# Altium project FSAES-23-E17 Temp Module.PrjPcb
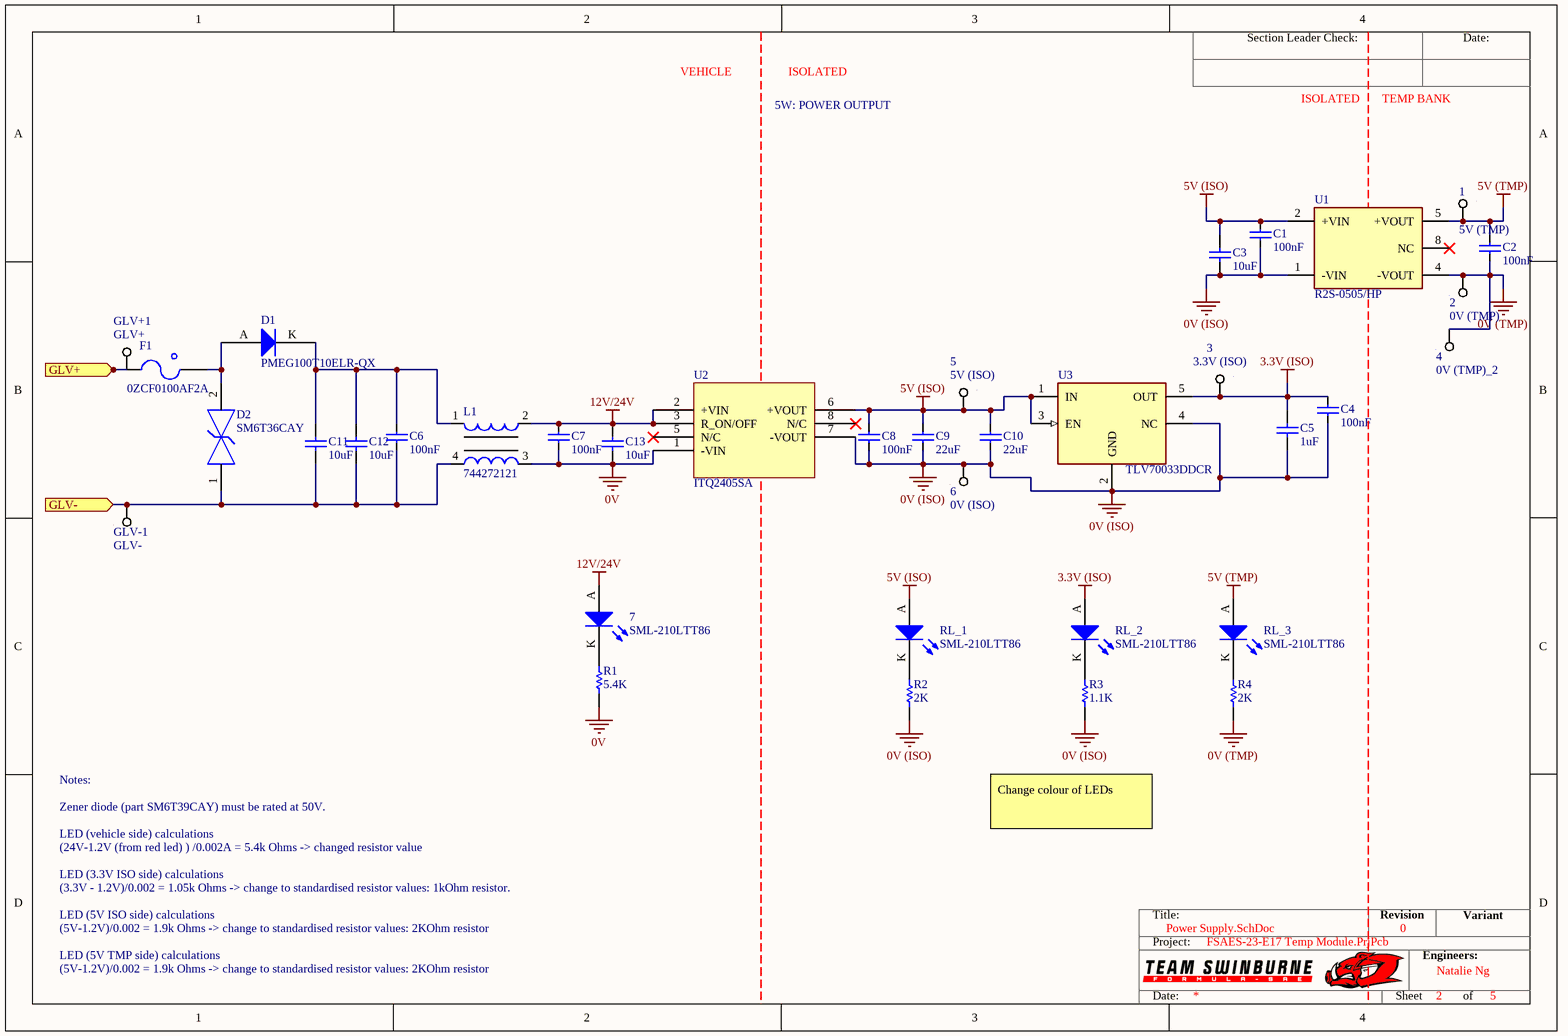
[diagram p0: Power Supply.SchDoc]
Engineers: Natalie Ng; Revision: 0
2 sheets, 75 parts. Net scope: flat (ports and power ports of the same name join across sheets).
Board file: FSAES-22-E17 Temp Module PCB.PcbDoc
Sheets:
  Power Supply.SchDoc
  Temp Bank.SchDoc

## Sheet Power Supply.SchDoc
size A4; SheetNumber: 2; SheetTotal: 5

### Parts
1  5V (TMP)  [SMD Test Point 1mm]
2  0V (TMP)  [SMD Test Point 1mm]
3  3.3V (ISO)  [SMD Test Point 1mm]
4  0V (TMP)_2
5  5V (ISO)  [SMD Test Point 1mm]
6  0V (ISO)  [SMD Test Point 1mm]
7  SML-210LTT86  [0805 LED]
C1  100nF  [0805]
C2  100nF  [0805]
C3  10uF  [0805]
C4  100nF  [0805]
C5  1uF  [0805]
C6  100nF  [0805]
C7  100nF  [0805]
C8  100nF  [0805]
C9  22uF  [C0805C226M9PAC7210-Footprint-1]
C10  22uF  [C0805C226M9PAC7210-Footprint-1]
C11  10uF  [CAPC2013X145X50NL20T25]
C12  10uF  [CAPC2013X145X50NL20T25]
C13  10uF  [CAPC2013X145X50NL20T25]
D1  PMEG100T10ELR-QX  [SODFL350X110-2N]
D2  SM6T36CAY  [FP-SMB-CA-MFG]
F1  0ZCF0100AF2A  [2920]
GLV+1  GLV+  [SMD Test Point 1mm]
GLV-1  GLV-  [SMD Test Point 1mm]
L1  744272121  [WE-SL5]
R1  5.4K  [RNCF0805BKY5K40-Footprint-1]
R2  2K  [0805]
R3  1.1K  [RESC0603]
R4  2K  [0805]
RL_1  SML-210LTT86  [0805 LED]
RL_2  SML-210LTT86  [0805 LED]
RL_3  SML-210LTT86  [0805 LED]
U1  R2S-0505/HP  [R2S-0505_HP-Footprint-1]
U2  ITQ2405SA  [ITQ2405SA-Footprint-1]
U3  TLV70033DDCR  [FP-DDC0005A-IPC_B]

### Ports
GLV+ (in), GLV- (in)

### Nets
0V: C7.2 C13.1 L1.3 R1.1 U2.1(-VIN)
0V (ISO): 6.1 C1.2 C3.1 C4.2 C5.1 C8.2 C9.1 C10.1 R2.1 R3.1 U1.1(-VIN) U2.7(-VOUT) U3.2(GND) U3.4(NC)
0V (TMP): 2.1 4.1 C2.2 R4.1 U1.4(-VOUT)
3.3V (ISO): 3.1 C4.1 C5.2 RL_2.A U3.5(OUT)
5V (ISO): 5.1 C1.1 C3.2 C8.1 C9.2 C10.2 RL_1.A U1.2(+VIN) U2.6(+VOUT) U3.1(IN) U3.3(EN)
5V (TMP): 1.1 C2.1 RL_3.A U1.5(+VOUT)  [project net AVDD]
12V/24V: 7.A C7.1 C13.2 L1.2 U2.2(+VIN) U2.3(R_ON/OFF)
Net7_K: 7.K R1.2
NetC6_1: C6.1 C11.2 C12.2 D1.K L1.1
NetC6_2: C6.2 C11.1 C12.1 D2.1 GLV-1.1 L1.4 ; port GLV-
NetD1_A: D1.A D2.2 F1.2
NetF1_1: F1.1 GLV+1.1 ; port GLV+
NetR2_2: R2.2 RL_1.K
NetR3_2: R3.2 RL_2.K
NetR4_2: R4.2 RL_3.K

Not connected (* = marked no-connect by the designer): U1 8(NC)*; U2 5(N/C)* 8(N/C)*

### Notes on the sheet
- VEHICLE
- 5W: POWER OUTPUT
- ISOLATED
- TEMP BANK
- Notes:
- (24V-1.2V (from red led) ) /0.002A = 5.4k Ohms -> changed resistor value
- LED (vehicle side) calculations
- Zener diode (part SM6T39CAY) must be rated at 50V.
- Change colour of LEDs
- LED (3.3V ISO side) calculations
- (3.3V - 1.2V)/0.002 = 1.05k Ohms -> change to standardised resistor values: 1kOhm resistor.
- LED (5V ISO side) calculations
- (5V-1.2V)/0.002 = 1.9k Ohms -> change to standardised resistor values: 2KOhm resistor
- LED (5V TMP side) calculations
- Section Leader Check:
- Date:
- Title:
- Revision
- Variant
- Project:
- Engineers:
- Sheet
- of

### Library data of the parts
1-3 5 6 GLV+1 GLV-1 = SMD Test Point Small: Positions: 1; Pitch: 0mm; Row Spacing: 0; Flange: No; Contact: NA; Part Number: SMD Test Point Small; Angle: 0
4 = CMP-061-000001-1: Design Item ID: Test Point Small; Source: Generic.SchLib
7 RL_1-RL_3 = CMP-025-000006-1: Red LED Indication - Discrete 1.75V 0805 (2012 Metric); Part Number: SML-210LTT86
C1 C2 C4 C6-C8 = CMP-00018-1: Cap Ceramic 0.1uF 25V X7R 10% Pad SMD 0805 125C Automotive T/R; Max Operating Temperature: 125°C; RoHS Compliant: Yes; Series: GCM; Case Code (Metric): 2012; Thickness: 0.055inch; Depth: 1.25mm; Width: 1.25mm; Package Quantity: 3000; Case Code (Imperial): 0805; Voltage Rating (DC): 25V; Dielectric: X7R; Construction: Flat; Height: 1.25mm; Ratings: AEC-Q200; Mount: Surface Mount; Voltage Rating: 25V; Tolerance: 10%; Length: 2mm; Case/Package: 0805; Packaging: Tape and Reel; Min Operating Temperature: -55°C; Radiation Hardening: No; Capacitance: 100nF; Termination: SMD/SMT
C3 = GRM21BR6YA106KE43L: Manufacturer: muRata; Tolerance: 10%; Material: X5R; Rated Voltage: 50V; Part Number: GRM21BR6YA106KE43L; Value: 10uF; Digikey Part Number: 490-10514-6-ND
C5 = AC0805KKX7R8BB105: Manufacturer: YAGEO; Tolerance: 10%; Material: X7R; Rated Voltage: 25V; Part Number: AC0805KKX7R8BB105; Value: 1uF; Digikey Part Number: DO NOT USE FOR NEW DESIGNS
C9 C10 = CMP-CAP-0012-1: Cap Ceramic 22uF 6.3V X5R 20% Pad SMD 0805 85C T/R; Length: 2mm; Tolerance: 20%; Depth: 1.25mm; ComponentLink1URL: https://www.digikey.com.au/en/products/detail/kemet/C0805C226M9PAC7210/12701503?utm_adgroup=Ceramic%20Capacitors&utm_source=google&utm_medium=cpc&utm_campaign=Shopping_Product_Capacitors&utm_term=&productid=12701503&utm_id=go_cmp-1056236628_adg-53401090298_ad-250137101738_pla-354083418645_dev-c_ext-_prd-12701503_sig-CjwKCAjwnZaVBhA6EiwAVVyv9KTEcqdxbqdQeMdm15seaf-EwUH-KMZCmj15MsoZE7WO92Q0RAY2FRoCkrcQAvD_BwE&gclid=CjwKCAjwnZaVBhA6EiwAVVyv9KTEcqdxbqdQeMdm15seaf-EwUH-KMZCmj15MsoZE7WO92Q0RAY2FRoCkrcQAvD_BwE; Min Operating Temperature: -55°C; RoHS Compliant: Yes; Packaging: Tape and Reel; Dielectric: X5R; Capacitance: 22uF; ComponentLink1Description: Digikey Link; Max Operating Temperature: 85°C; Case/Package: 0805
C11-C13 = CMP-CAP-0009-1: CAP CER 10UF 10V Y5V 0805; Dissipation Factor: 20%; Tolerance: 80%; Dielectric Material: Ceramic; Lead Free: Lead Free; Construction: Flat; Number of Pins: 2; Package Quantity: 1; Max Operating Temperature: 85°C; Resistor Type: Ceramic; Dielectric: Y5V; Capacitance: 10uF; Width: 0.049inch; REACH SVHC: No SVHC; Length: 2mm; Mount: Surface Mount; Case Code (Imperial): 0805; Case/Package: 0805; Termination: SMD/SMT; RoHS Compliant: Yes; Series: CC; Voltage Rating: 10V; Packaging: Tape and Reel; Depth: 1.25mm; Voltage Rating (DC): 10V; Height: 0.85mm; Thickness: 0.049inch; Case Code (Metric): 2012; Halogen Free: Halogen Free; Radiation Hardening: No; Min Operating Temperature: -30°C
D1 = CMP-004-00005-4: Diode 100 V 1A Surface Mount SOD-123W
D2 = CMP-004-00004-1: ESD Suppressors / TVS Diodes 600 W 4kW Transil 6V to 70V Bi; Number of Bidirectional Channels: 1; Leakage Current: 200nA; Peak Pulse Power: 600W; Test Current: 1mA; Clamping Voltage: 49.9V; Direction: Bidirectional; Operating Supply Voltage: 30V; Peak Pulse Current: 62A; Max Breakdown Voltage: 37.8V; Breakdown Voltage: 36V; Max Surge Current: 12A; Min Breakdown Voltage: 34.2V; Power Line Protection: No; Diode Type: ZENER; Reverse Standoff Voltage: 30.8V; Lead Free: Contains Lead; Mounting Technology: Surface Mount; Termination: SMD/SMT; Series: Automotive, AEC-Q101, SM6TY, TRANSIL™; Height: 2.45mm; Min Operating Temperature: -55°C; Reach SVHC Compliant: No; Max Power Dissipation: 600W; Case/Package: DO-214AA; Max Reverse Leakage Current: 200nA; Polarity: Bidirectional; Number of Elements: 1; Package Quantity: 1; RoHS Compliant: Yes; Packaging: Tape and Reel; Max Operating Temperature: 150°C; Width: 3.95mm; Reverse Breakdown Voltage: 34.2V; Number of Channels: 1; Length: 4.6mm; Pins: 2
F1 = CMP-018-000004-1: PTC RESET FUSE 60V 1A 292; Part Number: 0ZCF0100AF2A
L1 = CMP-00010-1: CMC 120UH 2.5A 2LN 460 OHM SMD; Voltage Rating (DC): 80V; Inductance Tolerance: 40%; Max Current Rating: 3A; Number of Lines: 2; Test Frequency: 100kHz; Resistance: 25mR; Core Material: Ferrite; Impedance: 460R; Max Operating Temperature: 125°C; Depth: 8.7mm; Min Operating Temperature: -40°C; Current Rating: 2.5A; Tolerance: 40%; Number of Pins: 4; Case/Package: SMD/SMT; Weight: 0.026103oz; Inductance: 120uH; Package Quantity: 1; Current: 2.5A; Width: 0.343inch; RoHS Compliant: Yes; Length: 0.394inch; DC Resistance (DCR): 25mR; Mount: Surface Mount; Termination: SMD/SMT; Packaging: Tape and Reel; Lead Free: Lead Free; Self Resonant Frequency: 100kHz; Height: 6.5mm; Series: WE-SL5; Max DC Current: 2.5A; Voltage Rating: 80V; REACH SVHC: No SVHC
R1 = CMP-RES-0158-2: RES SMD 5.4K OHM 0.125W 0805; Temperature Coefficient: 5ppm/°C; Max Power Dissipation: 125mW; Tolerance: 0.1%; Resistance: 5.4kR; Power Rating: 100mW; Series: RNCF; Packaging: Tape and Reel; RoHS Compliant: Yes; Min Operating Temperature: -55°C; Features: Automotive AEC-Q200; Mount: Surface Mount; Case/Package: 0805; Number of Terminations: 2; Max Operating Temperature: 155°C
R2 R4 = CMP-037-000309-3: RC0805FR072KL; Tolerance: 0.01; Rated Voltage: 0.125W; Value: 2k; Digikey Part Number: 311-2.00KCRCT-ND; Material: FR-07
R3 = CMP-RES-0079-1: RES SMD 1.1K OHM JUMPER 1/10W 0603; Voltage Rating: 50V; Tolerance: 1%; Power Rating: 100mW; Max Operating Temperature: 155°C; Case/Package: 0603; Min Operating Temperature: -55°C
U1 = CMP-00025-2: DC-DC Unregulated Power Supply Module, 1 Output, 2W, Hybrid; Max Output Voltage: 5.25V; Min Input Voltage: 4.5V; Qualification Status: Not Qualified; Number of Functions: 1; Max Input Voltage: 5.5V; Nominal Output Voltage: 5V; Trim/Adjustable Output: No; Max Output Current: 400mA; Min Output Voltage: 4.75V; Load Regulation-Max: 15%; Terminal Position: DUAL; Width: 10.7mm; Number of Pins: 5; Package Shape: Rectangular; Max Operating Temperature: 100°C; Package Style: MICROELECTRONIC ASSEMBLYMeter; RoHS Compliant: Yes; Package Code: SOP; Height - Seated (Max): 9.5mm; Analog IC - Other Type: DC-DC UNREGULATED POWER SUPPLY MODULE; Temperature Grade: INDUSTRIAL; Terminal Form: Flat; Reach SVHC Compliant: Yes; Min Operating Temperature: -40°C; Length: 12.75mm; Max Output Power: 2W; Number of Outputs: 1; Surface Mount: Yes; Terminal Pitch: 2.54mm; Nominal Input Voltage: 5V; Technology: HYBRID
U2 = CMP-001-0010-3: Dc-dc Converter, 6W Single O/p, 4: 1 Input Sip; Voltage - Output 1: 5V; Min Input Voltage (DC): 9V; Max Supply Voltage: 36V; Current - Output 1: 1.2A; Number of Outputs: 1; Efficiency: 84%; Isolation Voltage: 1.5kV; Series: ITQ; Max Output Power: 6W; Features: SCP; Min Operating Temperature: -40°C; Case/Package: SIP; Min Input Voltage: 9V; Max Power Dissipation: 6W; Length: 0.86inch; Max Operating Temperature: 100°C; Depth: 21.85mm; Max Output current: 1.2A; Reach SVHC Compliant: Unknown; Height: 0.44inch; RoHS Compliant: Yes; Mounting Technology: Through Hole,PCB; Width: 0.36inch; Packaging: Rail/Tube; Max Input Voltage (DC): 36V; Output Power: 6W
U3 = CMP-001-0011-2: Fixed Positive LDO Regulator, 3.3V, 0.25V Dropout, PMOS, PDSO5; Dropout Voltage1-Nom: 175mV; Input Voltage Absolute-Max: 6V; Package Equivalence Code: TSOP5/6,.11,37; Package Body Material: Plastic; Voltage Tolerance-Max: 2%; Max Supply Voltage: 5.5V; Channels: 1; Dropout Voltage1-Max: 250mV; Regulator Type: FIXED POSITIVE SINGLE OUTPUT LDO REGULATOR; Output Current1-Max: 200mA; Min Input Voltage: 2V; Output Voltage1-Min: 3.234V; Load Regulation-Max: 0.015%; Line Regulation-Max: 0.005%; Output Voltage1-Max: 3.366V; Qualification Status: Not Qualified; Reach SVHC Compliant: Yes; JESD-30 Code: R-PDSO-G5; Terminal Position: DUAL; Pins: 5; Moisture Sensitivity Level: 2; Length: 2.9mm; Operating Temperature, TJ-Min: -40°C; Operating Temperature, TJ-Max: 125°C; Package Shape: Rectangular; Output Voltage1-Nom: 3.3V; Packaging: Tape and Reel; Surface Mount: Yes; Number of Outputs: 1; JESD-609 Code: e4; Adjustability: FIXED; Technology: PMOS; Peak Reflow Temperature (Cel): 260°C; Terminal Form: Gull Wing; Case/Package: TSSOP; Height - Seated (Max): 1.1mm; Package Style: SMALL OUTLINE, THIN PROFILE, SHRINK PITCHMeter; Terminal Finish: Nickel; RoHS Compliant: Yes; Terminal Pitch: 0.95mm; Width: 1.6mm

## Sheet Temp Bank.SchDoc
size A3; SheetNumber: 5; SheetTotal: 5
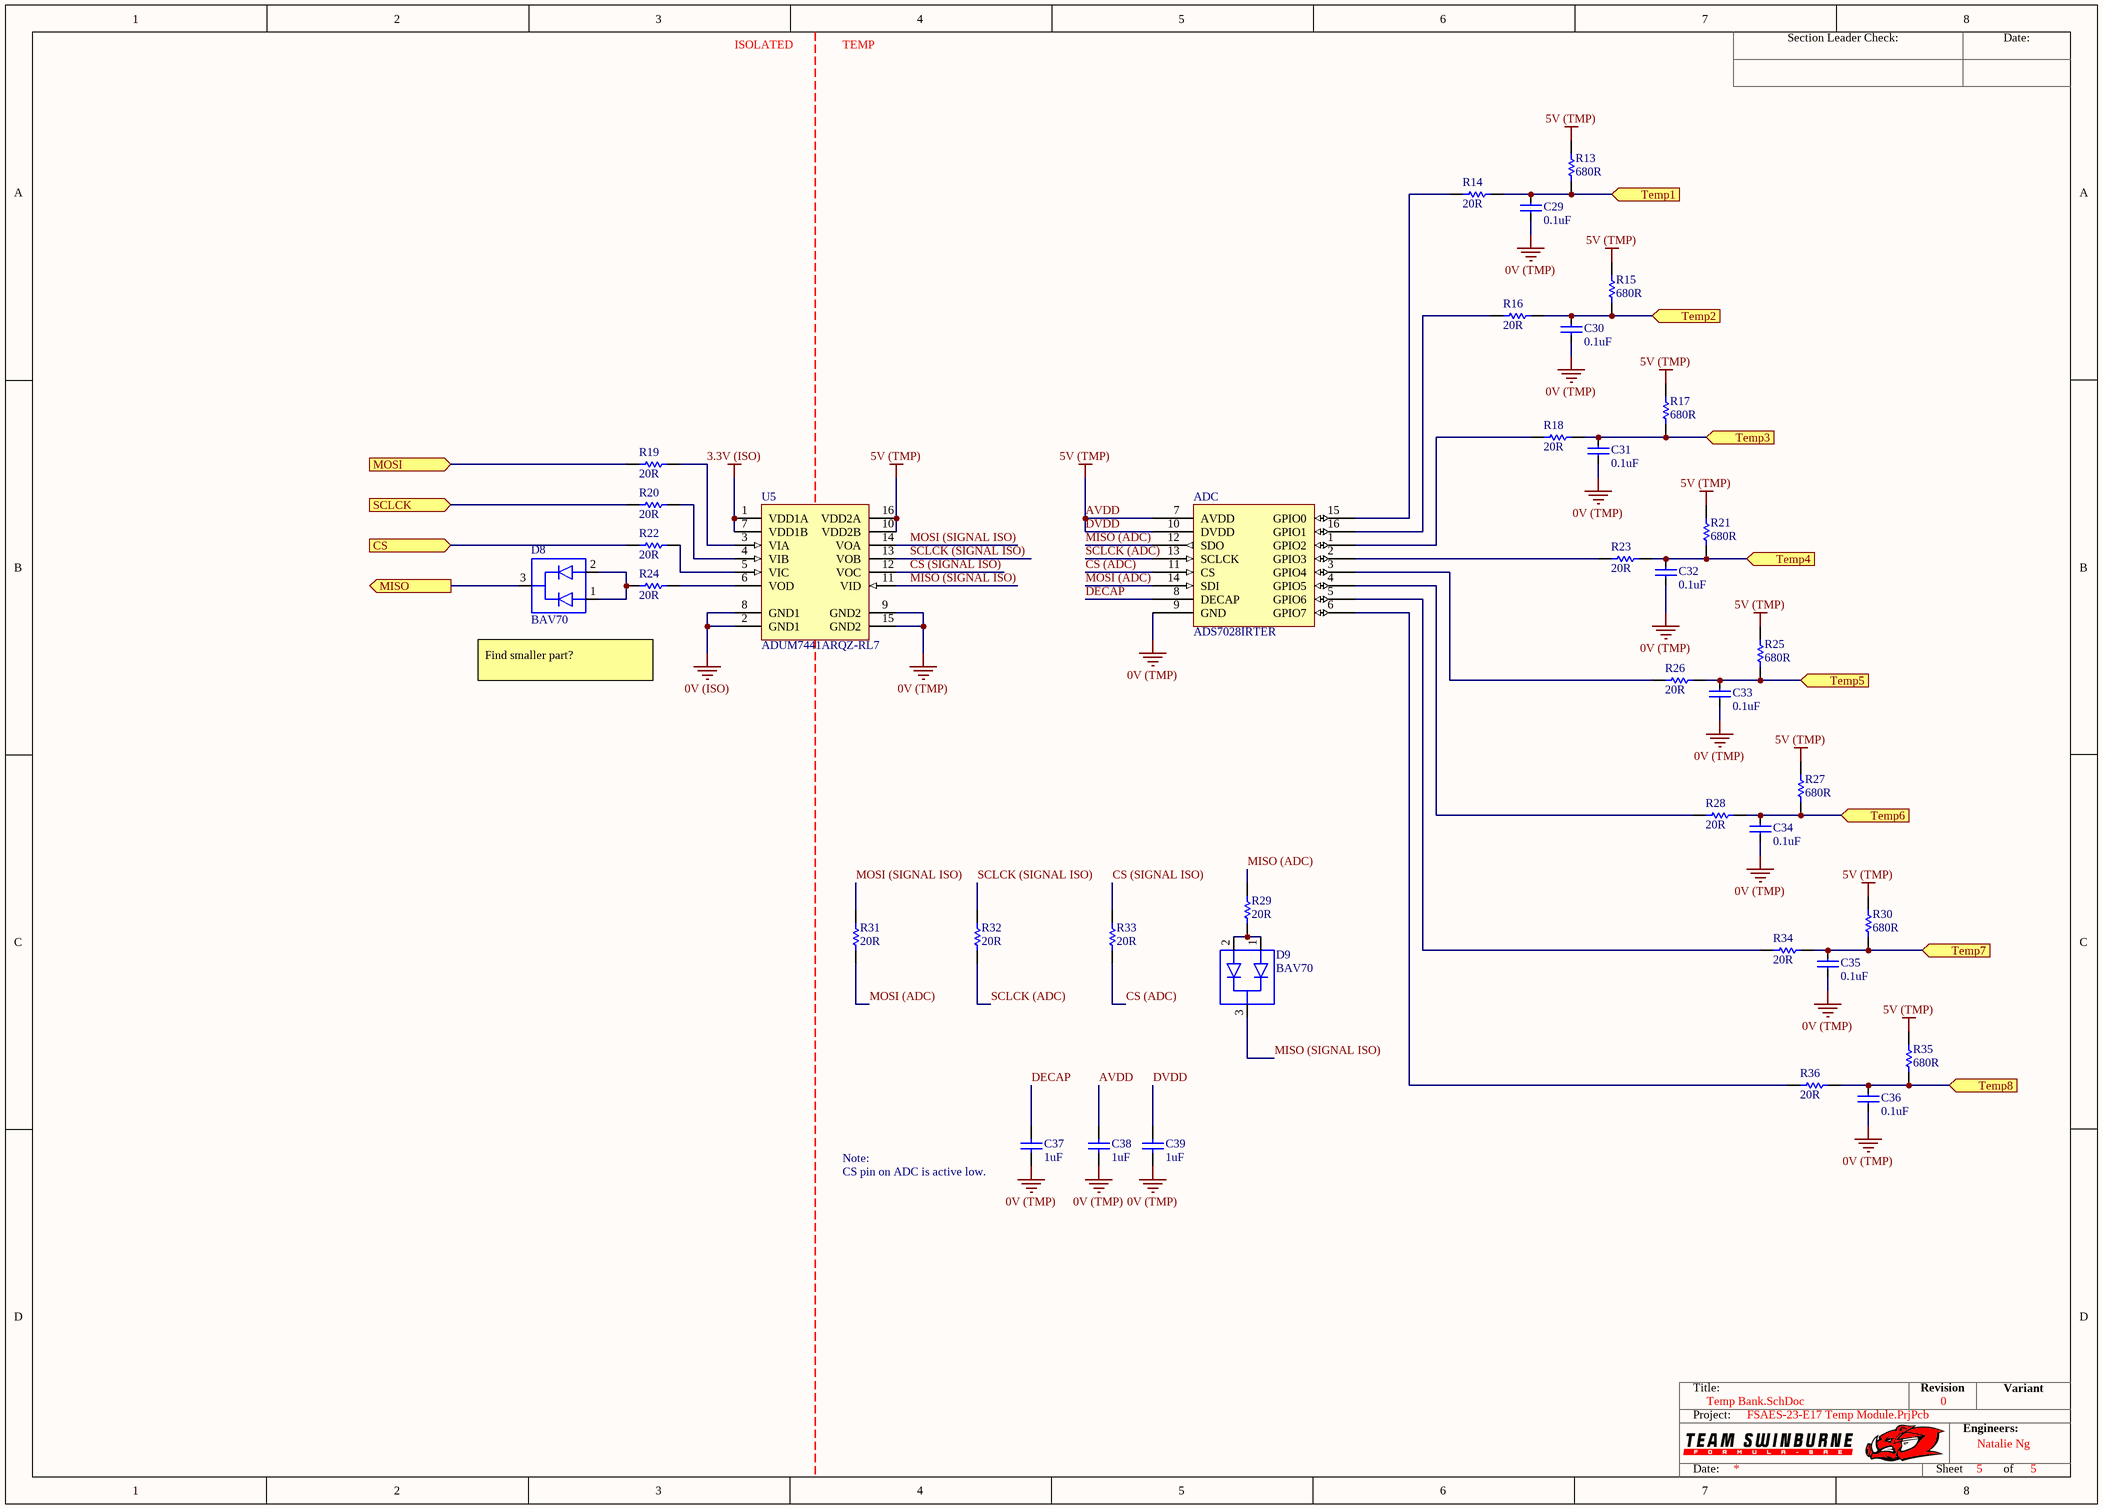
[diagram p1: Temp Bank.SchDoc]

### Parts
ADC  ADS7028IRTER  [QFN50P300X300X80_HS-17N]
C29  0.1uF  [0805]
C30  0.1uF  [0805]
C31  0.1uF  [0805]
C32  0.1uF  [0805]
C33  0.1uF  [0805]
C34  0.1uF  [0805]
C35  0.1uF  [0805]
C36  0.1uF  [0805]
C37  1uF  [0805]
C38  1uF  [0805]
C39  1uF  [0805]
D8  BAV70  [BAV70-Footprint-1]
D9  BAV70  [BAV70-Footprint-1]
R13  680R  [0805]
R14  20R  [RESC0603]
R15  680R  [0805]
R16  20R  [RESC0603]
R17  680R  [0805]
R18  20R  [RESC0603]
R19  20R  [RESC0603]
R20  20R  [RESC0603]
R21  680R  [0805]
R22  20R  [RESC0603]
R23  20R  [RESC0603]
R24  20R  [RESC0603]
R25  680R  [0805]
R26  20R  [RESC0603]
R27  680R  [0805]
R28  20R  [RESC0603]
R29  20R  [RESC0603]
R30  680R  [0805]
R31  20R  [RESC0603]
R32  20R  [RESC0603]
R33  20R  [RESC0603]
R34  20R  [RESC0603]
R35  680R  [0805]
R36  20R  [RESC0603]
U5  ADUM7441ARQZ-RL7  [ADI-RQ-16_M]

### Ports
CS (in), MISO (out), MOSI (in), SCLCK (in), Temp1 (in), Temp2 (in), Temp3 (in), Temp4 (in), Temp5 (in), Temp6 (in), Temp7 (in), Temp8 (in)

### Nets
0V (ISO): U5.2(GND1) U5.8(GND1)
0V (TMP): ADC.9(GND) C29.2 C30.2 C31.2 C32.2 C33.2 C34.2 C35.2 C36.2 C37.1 C38.1 C39.1 U5.9(GND2) U5.15(GND2)
3.3V (ISO): U5.1(VDD1A) U5.7(VDD1B)
AVDD: ADC.7(AVDD) ADC.10(DVDD) C38.2 C39.2 R13.2 R15.2 R17.2 R21.2 R25.2 R27.2 R30.2 R35.2 U5.10(VDD2B) U5.16(VDD2A)  [also labelled 5V (TMP), DVDD]
CS (ADC): ADC.11(CS) R33.1
CS (SIGNAL ISO): R33.2 U5.12(VOC)
DECAP: ADC.8(DECAP) C37.2
MISO (ADC): ADC.12(SDO) R29.2
MISO (SIGNAL ISO): D9.3(CC) U5.11(VID)
MOSI (ADC): ADC.14(SDI) R31.1
MOSI (SIGNAL ISO): R31.2 U5.14(VOA)
SCLCK (ADC): ADC.13(SCLCK) R32.1
SCLCK (SIGNAL ISO): R32.2 U5.13(VOB)
NetADC_1: ADC.1(GPIO2) R18.1
NetADC_2: ADC.2(GPIO3) R23.1
NetADC_3: ADC.3(GPIO4) R26.1
NetADC_4: ADC.4(GPIO5) R28.1
NetADC_5: ADC.5(GPIO6) R34.1
NetADC_6: ADC.6(GPIO7) R36.1
NetADC_15: ADC.15(GPIO0) R14.1
NetADC_16: ADC.16(GPIO1) R16.1
NetC29_1: C29.1 R13.1 R14.2 ; port Temp1
NetC30_1: C30.1 R15.1 R16.2 ; port Temp2
NetC31_1: C31.1 R17.1 R18.2 ; port Temp3
NetC32_1: C32.1 R21.1 R23.2 ; port Temp4
NetC33_1: C33.1 R25.1 R26.2 ; port Temp5
NetC34_1: C34.1 R27.1 R28.2 ; port Temp6
NetC35_1: C35.1 R30.1 R34.2 ; port Temp7
NetC36_1: C36.1 R35.1 R36.2 ; port Temp8
NetD8_1: D8.1(A1) D8.2(A2) R24.1
NetD8_3: D8.3(CC) ; port MISO
NetD9_1: D9.1(A1) D9.2(A2) R29.1
NetR19_1: R19.1 ; port MOSI
NetR19_2: R19.2 U5.3(VIA)
NetR20_1: R20.1 ; port SCLCK
NetR20_2: R20.2 U5.4(VIB)
NetR22_1: R22.1 ; port CS
NetR22_2: R22.2 U5.5(VIC)
NetR24_2: R24.2 U5.6(VOD)

### Notes on the sheet
- ISOLATED
- TEMP
- Find smaller part?
- Note:
- (near C37) CS pin on ADC is active low.
- Section Leader Check:
- Date:
- Title:
- Revision
- Variant
- Project:
- Engineers:
- Sheet
- of

### Library data of the parts
ADC = CMP-001-0002-13: Small 8-channel 12-bit analog-to-digital converter (ADC) with SPI, GPIOs and CRC 16-WQFN -40 to 85
C29-C36 = CMP-00018-1: Cap Ceramic 0.1uF 25V X7R 10% Pad SMD 0805 125C Automotive T/R; Capacitance: 100nF; Max Operating Temperature: 125°C; RoHS Compliant: Yes; Series: GCM; Case Code (Metric): 2012; Thickness: 0.055inch; Depth: 1.25mm; Width: 1.25mm; Package Quantity: 3000; Case Code (Imperial): 0805; Voltage Rating (DC): 25V; Dielectric: X7R; Construction: Flat; Height: 1.25mm; Ratings: AEC-Q200; Mount: Surface Mount; Voltage Rating: 25V; Tolerance: 10%; Length: 2mm; Case/Package: 0805; Packaging: Tape and Reel; Min Operating Temperature: -55°C; Radiation Hardening: No; Termination: SMD/SMT
C37-C39 = AC0805KKX7R8BB105: as C5 on sheet Power Supply; Part Number: AC0805KKX7R8BB105; Value: 1uF; Digikey Part Number: DO NOT USE FOR NEW DESIGNS
D8 D9 = CMP-004-00001-1: DIODE ARRAY GP 70V 200mA SOT23-3; RoHS Compliant: No
R13 R15 R17 R21 R25 R27 R30 R35 = CMP-037-000298-3: RC0805FR07680RL; Rated Voltage: 0.125W; Tolerance: 0.01; Material: FR-07; Digikey Part Number: 311-680CRCT-ND; Value: 680R
R14 R16 R18-R20 R22-R24 R26 R28 R29 R31-R34 R36 = CMP-RES-0043-1: RES SMD 20 OHM JUMPER 1/10W 0603; Voltage Rating: 50V; Tolerance: 1%; Power Rating: 100mW; Case/Package: 0603; Min Operating Temperature: -55°C; Max Operating Temperature: 155°C
U5 = CMP-001-0005-5: Digital Isolator CMOS 4-CH 1Mbps 16-Pin QSOP T/R; Pulse Width Distortion (PWD): 25ns; Nominal Supply Current: 4.1mA; Data Rate: 25Mbps; Turn-On Delay Time: 56ns; Max Supply Voltage: 5.5V; Isolated Power: No; Min Supply Voltage: 3V; Propagation Delay: 75ns; Channel Type: Unidirectional; Number of Channels: 4; Lead Free: Contains Lead; Number of Pins: 16; Contact Plating: Tin,Matte; RoHS Compliant: Yes; Package Quantity: 1000; Type: General Purpose; Supply Current: 4.1mA; Case/Package: QSOP; Max Operating Temperature: 105°C; Packaging: Tape and Reel; Series: iCoupler®; Min Operating Temperature: -40°C

## Nets that join several sheets
0V (ISO): Power Supply (14 pins), Temp Bank (U5.2 U5.8)
0V (TMP): Power Supply (5 pins), Temp Bank (14 pins)
3.3V (ISO): Power Supply (5 pins), Temp Bank (U5.1 U5.7)
AVDD: Power Supply (1.1 C2.1 RL_3.A U1.5), Temp Bank (14 pins)